# Altium project DLU_PPK57.PrjPCB (part 1 of 2)
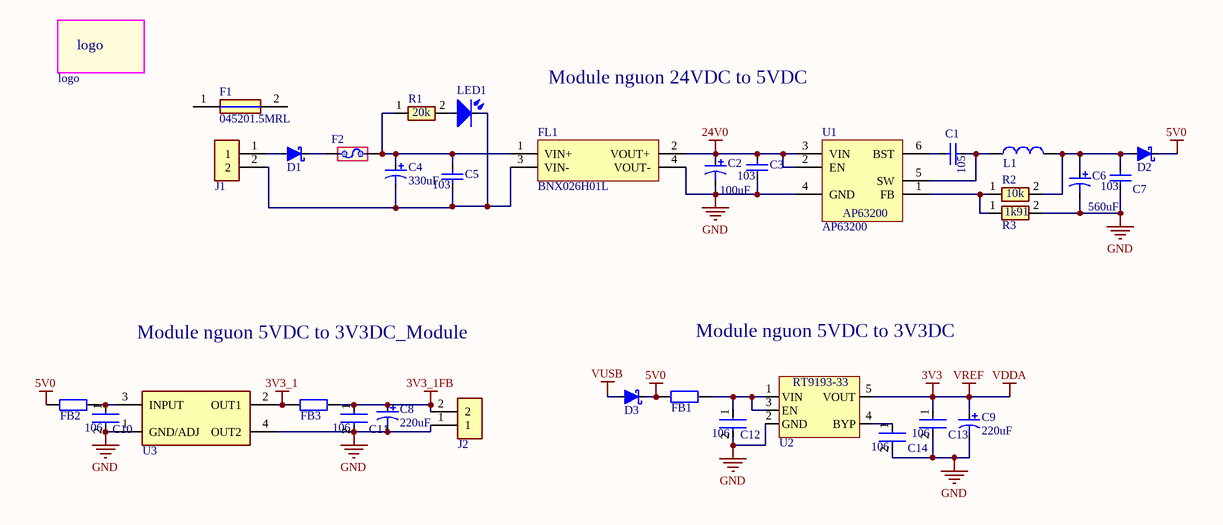
[diagram p0: [1]-Power.SchDoc]
4 sheets, 182 parts. Net scope: flat (ports and power ports of the same name join across sheets).
Board file: DLU_PPK57.PcbDoc
Sheets:
  [1]-Power.SchDoc
  [2]-MCU.SchDoc
  [3]-Digital Input.SchDoc
  [4]-GPS_SIM_SSD.SchDoc

## Sheet [1]-Power.SchDoc
size A4; DocumentNumber: 1; SheetNumber: 1; SheetTotal: 5

### Parts
1  logo  [logo_new_10mm]  (no BOM)
C1  C0603_105_50V  [C0603]  (value not drawn)
C2  100uF  [CAP_ALUM_6_5x6_5]
C3  C0603_103_50V  [C0603]  (value not drawn)
C4  330uF  [CAP_ALUM_10X10]
C5  C0603_103_50V  [C0603]  (value not drawn)
C6  value 560uF  [CAP_ALUM_6_5x6_5]  (hidden comment: CAP_ALU6.3_560uF_6.3V)
C7  C0603_103_50V  [C0603]  (value not drawn)
C8  value 220uF  [CAP_TAN_7343]  (hidden comment: CAP_TAN_7343_220uF_16V)
C9  value 220uF  [CAP_TAN_7343]  (hidden comment: CAP_TAN_7343_220uF_16V)
C10  C0603_106_35V  [C0603]  (value not drawn)
C11  C0603_106_35V  [C0603]  (value not drawn)
C12  C0603_106_35V  [C0603]  (value not drawn)
C13  C0603_106_35V  [C0603]  (value not drawn)
C14  C0603_106_35V  [C0603]  (value not drawn)
D1  PMEG40T30ERX  [SOD123]  (value not drawn)
D2  PMEG40T30ERX  [SOD123]  (value not drawn)
D3  PMEG40T30ERX  [SOD123]  (value not drawn)
F1  045201.5MRL
F2  01550900M  [FUSE_HOLDER_SMD]  (value not drawn)
FB1  FERRIT_0805_1A  [FB0805]  (value not drawn)
FB2  FERRIT_0805_1A  [FB0805]  (value not drawn)
FB3  FERRIT_0805_1A  [FB0805]  (value not drawn)
FL1  BNX026H01L  [BNX024]
J1  Terminal_2P_5.08mm  [1729128]  (value not drawn)
J2  Terminal_2P_5.08mm  [1729128]  (value not drawn)
L1  IND_4.7U_1.82A_4.5X4.0  [IND_4.5x4]  (value not drawn)
LED1  LED0603_Blue  [LED0603]  (value not drawn)
R1  R0603_20k  [RES-SMD-0603]  (value not drawn)
R2  R0603_10k  [RES-SMD-0603]  (value not drawn)
R3  R0603_1k91  [RES-SMD-0603]  (value not drawn)
U1  AP63200  [SOT-23-6]
U2  RT9193-33GB  [SOT-23-5]  (value not drawn)
U3  NCP1117ST33T3G  [SOT230P700X180-4N]  (value not drawn)

### Nets
3V3: C9.1 C13.1 U2.5(VOUT)  [also labelled VDDA, VREF]
3V3_1: FB3.1 U3.2(OUT1)
3V3_1FB: C8.1 C11.1 FB3.2 J2.2
5V0: D2.2(K) D3.2(K) FB1.1 FB2.1
24V0: C2.1 C3.1 FL1.2(VOUT+) U1.2(EN) U1.3(VIN)
GND: C2.2 C3.2 C6.2 C7.2 C8.2 C9.2 C10.2 C11.2 C12.2 C13.2 C14.2 FL1.4(VOUT-) J2.1 R3.2 U1.4(GND) U2.2(GND) U3.1(GND/ADJ) U3.4(OUT2)
VUSB: D3.1(A)
NetC1_1: C1.1 U1.6(BST)
NetC1_2: C1.2 L1.1 U1.5(SW)
NetC4_1: C4.1 C5.1 F2.2 FL1.1(VIN+) R1.1
NetC4_2: C4.2 C5.2 FL1.3(VIN-) J1.2 LED1.1(K)
NetC6_1: C6.1 C7.1 D2.1(A) L1.2 R2.2
NetC10_1: C10.1 FB2.2 U3.3(INPUT)
NetC12_1: C12.1 FB1.2 U2.1(VIN) U2.3(EN)
NetC14_1: C14.1 U2.4(BYP)
NetD1_1: D1.1(A) J1.1
NetD1_2: D1.2(K) F2.1
NetLED1_2: LED1.2(A) R1.2
NetR2_1: R2.1 R3.1 U1.1(FB)

Not connected (* = marked no-connect by the designer): F1 1 2

### Notes on the sheet
- Module nguon 24VDC to 5VDC
- Module nguon 5VDC to 3V3DC_Module
- Module nguon 5VDC to 3V3DC
- Sửa đổi
- 1
- Miêu tả
- CHỈNH SỬA
- Khu vực
- Thời gian
- 2
- 3
- 4
- Họ Tên
- Chữ ký
- Ngày ký
- TỔNG CÔNG TY CÔNG NGHIỆP CNC VIETTEL
- Mã dự án
- THIẾT KẾ:
- XUẤT BẢN VẼ:
- Bản vẽ thiết kế sơ đồ nguyên lý
- TRUNG TÂM CN CK & TĐH
- KHỐI 1
- KIỂM TRA:
- Mã thiết bị
- Mã bản vẽ
- PHÊ DUYỆT:
- Tên file:
- Mã phiên bản
- Kích thước
- A4
- Trang
- (in symbol C0603_103_50V) 103
- (in symbol C0603_105_50V) 105
- (in symbol C0603_106_35V) 106
- (in symbol R0603_1k91) 1k91
- (in symbol R0603_10k) 10k
- (in symbol R0603_20k) 20k
- (in symbol RT9193-33GB) RT9193-33

### Library data of the parts
C1 = C0603_105_50V: Multilayer Ceramic Capacitors MLCC - SMD/SMT 50 V 1uF X7R 0603 10%; Manufacturer_Name: KEMET; Manufacturer_Part_Number: CC0603KRX7R9BB105; Datasheet Link: https://componentsearchengine.com/Datasheets/1/CC0603KRX7R9BB105.pdf; Height: 0.9mm; Mouser Part Number: 603-CC603KRX7R9BB105; Mouser Price/Stock: https://www.mouser.co.uk/ProductDetail/YAGEO/CC0603KRX7R9BB105?qs=6wERJjOp3mmF17%252BYi8cgJQ%3D%3D; Arrow Part Number: CC0603KRX7R9BB105; Arrow Price/Stock: https://www.arrow.com/en/products/cc0603krx7r9bb105/yageo
C2 = C_Al_100uF_35V: Capacitor Polarised; Manufacturer_Name: Panasonic; Manufacturer_Part_Number: EEH-ZK1V101XP; Datasheet Link: http://industrial.panasonic.com/cdbs/www-data/pdf/RDD0000/ABA0000C1229.pdf; Height: 8.3mm; Mouser Part Number: 667-EEH-ZK1V101XP; Mouser Price/Stock: https://www.mouser.co.uk/ProductDetail/Panasonic/EEH-ZK1V101XP?qs=FNcb6ahWXRxBYa2YKGAU8g%3D%3D; Arrow Part Number: EEH-ZK1V101XP; Arrow Price/Stock: https://www.arrow.com/en/products/eeh-zk1v101xp/panasonic
C3 C5 C7 = C0603_103_50V: Multilayer Ceramic Capacitors MLCC - SMD/SMT 50V 0.01uF X7R 0603 10%; Manufacturer_Name: KEMET; Manufacturer_Part_Number: CC0603KRX7R9BB103; Datasheet Link: https://datasheet.datasheetarchive.com/originals/distributors/Datasheets_SAMA/d9f127a4875522309d99aa7dec79633c.pdf; Height: 0.9mm; Mouser Part Number: 603-CC603KRX7R9BB103; Mouser Price/Stock: https://www.mouser.co.uk/ProductDetail/YAGEO/CC0603KRX7R9BB103?qs=AgBp2OyFlx%252BeoRRspw6PJg%3D%3D; Arrow Part Number: CC0603KRX7R9BB103; Arrow Price/Stock: https://www.arrow.com/en/products/cc0603krx7r9bb103/yageo?region=nac
C4 = C_Al_330uF_35V: Aluminum Organic Polymer Capacitors 35Vol 330uF SMD 2KHr ESR=22 mOhms AECQ200; Manufacturer_Name: KEMET; Manufacturer_Part_Number: A768MS337M1VLAS022; Datasheet Link: https://www.mouser.vn/datasheet/2/447/KEM_A4088_A768-3316438.pdf; Height: 12.2 mm; Mouser Part Number: 80-A768MS337M1VLAS22; Mouser Price/Stock: https://www.mouser.vn/ProductDetail/KEMET/A768MS337M1VLAS022?qs=sPbYRqrBIVliRmrbB6XsUw%3D%3D; ComponentLink1Description: Link; ComponentLink1URL: https://www.mouser.vn/ProductDetail/KEMET/A768MS337M1VLAS022?qs=sPbYRqrBIVliRmrbB6XsUw%3D%3D
C6 = CAP_ALU6.3_560uF_6.3V: 560 µF 6.3 V Aluminum - Polymer Capacitors Radial, Can - SMD 8mOhm 15000 Hrs @ 105°C; Manufacturer: United Chemi-Con; Part Number: APXJ6R3ARA561MF80G; Info: CAP ALUM POLY 560UF 20% 6.3V SMD; Temperature: -55°C ~ 105°C; URL: https://www.digikey.com/en/products/detail/chemi-con/APXJ6R3ARA561MF80G/10486574?s=N4IgjCBcoGwJxVAYygMwIYBsDOBTANCAPZQDaIALAAxwDMdIAuoQA4AuUIAymwE4CWAOwDmIAL6EA7ACYKiECkgYcBYmRDS4FAKzbpTVh0jc%2BQ0RJAAOS3OgK0WPIRKRyYGDDC0DIdpx4CIuKE0lQUCHaKyk5qriDaMFQABACtAGI%2BfsYAqoL8bADyqACyuOjYAK68uMEaVJIRyA4qzuowAHS0SQBqIIRgyb3MvkYguflFpeVVNRYAtPqRUHwVqi7k2n0gCIxie0A; Price: 0.87; Manufacturer Part Number: APXJ6R3ARA561MF80G
C8 C9 = CAP_TAN_7343_220uF_16V: 220 µF Molded Tantalum Capacitors 16 V 2917 (7343 Metric) 25mOhm; Manufacturer: KYOCERA AVX; Part Number: TPME227K016R0025; Info: CAP TANT 220UF 10% 16V 2917; Temperature: -55°C ~ 125°C; URL: https://www.digikey.com/en/products/detail/kyocera-avx/TPME227K016R0025/929934; Price: 4.54; Manufacturer Part Number: TPME227K016R0025
C10-C14 = C0603_106_35V: Multilayer Ceramic Capacitors MLCC - SMD/SMT 10 uF 35 VDC 20% 0603 X5R; Manufacturer_Name: Murata Electronics; Manufacturer_Part_Number: GRM188R6YA106MA73J; Datasheet Link: http://componentsearchengine.com/Datasheets/1/GRM188R6YA106MA73J.pdf; Height: 0.9mm; Mouser Part Number: 81-GRM188R6YA106MA3J; Mouser Price/Stock: https://www.mouser.co.uk/ProductDetail/Murata-Electronics/GRM188R6YA106MA73J?qs=5aG0NVq1C4xLSwNPdfnaYg%3D%3D; Arrow Part Number: GRM188R6YA106MA73J; Arrow Price/Stock: https://www.arrow.com/en/products/grm188r6ya106ma73j/murata-manufacturing?region=europe
D1-D3 = PMEG40T30ERX: Schottky Diode 40V 3A; Manufacturer_Name: Nexperia; Datasheet Link: https://assets.nexperia.com/documents/data-sheet/PMEG40T30ER.pdf; Height: 1.1mm; Manufacturer_Part_Number: PMEG40T30ERX; Mouser Part Number: 771-PMEG40T30ERX; Mouser Price/Stock: https://www.mouser.co.uk/ProductDetail/Nexperia/PMEG40T30ERX?qs=1mbolxNpo8eeG%2Fr5KLvXLA%3D%3D; Arrow Part Number: PMEG40T30ERX; Arrow Price/Stock: https://www.arrow.com/en/products/pmeg40t30erx/nexperia?region=europe
F1 = 045201.5MRL: Fuse; Manufacturer_Name: LITTELFUSE; Datasheet Link: https://componentsearchengine.com/Datasheets/2/045201.5MRL.pdf; Height: 2.69mm; Manufacturer_Part_Number: 045201.5MRL; Mouser Part Number: 576-045201.5MRL; Mouser Price/Stock: https://www.mouser.co.uk/ProductDetail/Littelfuse/045201.5MRL?qs=WtG364jHAdxFkoGkhC9sHA%3D%3D; Arrow Part Number: 045201.5MRL; Arrow Price/Stock: https://www.arrow.com/en/products/045201.5mrl/littelfuse?region=nac
F2 = 01550900M: Fuse holder; Manufacturer_Name: LITTELFUSE; Datasheet Link: http://www.littelfuse.com/~/media/electronics/datasheets/fuses/littelfuse_fuse_154_154t_154l_154tl_datasheet.pdf.pdf; Height: 3.81mm; Manufacturer_Part_Number: 01550900M; Mouser Part Number: 576-01550900M; Mouser Price/Stock: https://www.mouser.co.uk/ProductDetail/Littelfuse/01550900M?qs=DDoybve0rC%252BTXq1hqi5X1g%3D%3D; Arrow Part Number: 01550900M; Arrow Price/Stock: https://www.arrow.com/en/products/01550900m/littelfuse?region=europe
FB1-FB3 = FERRIT_0805_1A: Manufacturer: Laird-Signal Integrity Products; Part Number: MI0805J102R-10; info: FERRITE BEAD 1 KOHM 0805 1LN; Temperature: -40°C ~ 125°C; URL: https://www.digikey.com/en/products/detail/laird-signal-integrity-products/MI0805J102R-10/1015975; Price: 0.2; Manufacturer Part Number: MI0805J102R-10
FL1 = BNX026H01L: Filter; Manufacturer_Name: Murata Electronics; Datasheet Link: https://www.murata.com/en-us/products/productdetail?partno=BNX026H01%23; Height: 3.7mm; Manufacturer_Part_Number: BNX026H01L; Mouser Part Number: 81-BNX026H01L; Mouser Price/Stock: https://www.mouser.co.uk/ProductDetail/Murata-Electronics/BNX026H01L?qs=zU3EaVYbc3y78A%2FfsSIPhQ%3D%3D; Arrow Part Number: BNX026H01L; Arrow Price/Stock: https://www.arrow.com/en/products/bnx026h01l/murata-manufacturing?region=nac
J1 J2 = Terminal_2P_5.08mm: Fixed Terminal Blocks 2P 5.08mm 90DEG; Manufacturer_Name: Phoenix Contact; Datasheet Link: http://www.phoenixcontact.net/product/1729128; Height: 10.15mm; Manufacturer_Part_Number: 1729128; Mouser Part Number: 651-1729128; Mouser Price/Stock: https://www.mouser.co.uk/ProductDetail/Phoenix-Contact/1729128?qs=GFUSqQMLmmnCBVBY3dts9w%3D%3D; Arrow Part Number: 1729128; Arrow Price/Stock: https://www.arrow.com/en/products/1729128/phoenix-contact?region=nac
L1 = IND_4.7U_1.82A_4.5X4.0: Manufacturer: Würth Elektronik; Part Number: 744773047; info: FIXED IND 4.7UH 1.82A 110MOHM SM; Value: 4.7uH; Temperature: -40°C ~ 125°C; URL: https://www.digikey.com/en/products/detail/w%C3%BCrth-elektronik/744773047/1638657; Price: 1.8; Manufacturer Part Number: 744773047
LED1 = LED0603_Blue: Blue 470nm LED Indication - Discrete 3.2V 0603 (1608 Metric); Manufacturer_Name: Wurth Elektronik; Manufacturer_Part_Number: 150060BS75000; Datasheet Link: https://componentsearchengine.com/Datasheets/2/150060BS75000.pdf; Height: 0.8mm; Mouser Part Number: 710-150060BS75000; Mouser Price/Stock: https://www.mouser.co.uk/ProductDetail/Wurth-Elektronik/150060BS75000?qs=LlUlMxKIyB2DLLpXQThavA%3D%3D
R1 = R0603_20k: Resistor; Manufacturer_Name: Panasonic; Manufacturer_Part_Number: ERJ-3EKF2002V; Datasheet Link: http://industrial.panasonic.com/cdbs/www-data/pdf/RDA0000/AOA0000C86.pdf; Height: 0.55mm; Mouser Part Number: 667-ERJ-3EKF2002V; Mouser Price/Stock: https://www.mouser.co.uk/ProductDetail/Panasonic/ERJ-3EKF2002V?qs=66DK8nO8gJB3y0uxig0mNg%3D%3D; Arrow Part Number: ERJ-3EKF2002V; Arrow Price/Stock: https://www.arrow.com/en/products/erj-3ekf2002v/panasonic?region=europe
R2 = R0603_10k: Thick Film Resistors - SMD 0603 10Kohms 1% AEC-Q200; Manufacturer_Name: Panasonic; Manufacturer_Part_Number: ERJ-3EKF1002V; Datasheet Link: http://industrial.panasonic.com/cdbs/www-data/pdf/RDA0000/AOA0000C86.pdf; Height: 0.55mm; Mouser Part Number: 667-ERJ-3EKF1002V; Mouser Price/Stock: https://www.mouser.co.uk/ProductDetail/Panasonic/ERJ-3EKF1002V?qs=H7k1u0Mp9JSrGPQ5%2F5COuw%3D%3D; Arrow Part Number: ERJ-3EKF1002V; Arrow Price/Stock: https://www.arrow.com/en/products/erj-3ekf1002v/panasonic?region=europe
R3 = R0603_1k91: Resistor; Manufacturer_Name: Panasonic; Manufacturer_Part_Number: ERJ-3EKF1911V; Datasheet Link: http://industrial.panasonic.com/cdbs/www-data/pdf/RDA0000/AOA0000C86.pdf; Height: 0.55mm; Mouser Part Number: 667-ERJ-3EKF1911V; Mouser Price/Stock: https://www.mouser.co.uk/ProductDetail/Panasonic/ERJ-3EKF1911V?qs=66DK8nO8gJBdy91mE9RmMA%3D%3D; Arrow Part Number: ERJ-3EKF1911V; Arrow Price/Stock: https://www.arrow.com/en/products/erj-3ekf1911v/panasonic?region=nac
U1 = AP63200: Buck Switching Regulator IC Positive Adjustable 1.2V 1 Output 2A SOT-23-6 Thin, TSOT-23-6; Manufacturer: Diodes Incorporated; Part Number: AP63200WU-7; Temperature: -40°C ~ 85°C (TA); URL: https://www.digikey.com/en/products/detail/diodes-incorporated/AP63200WU-7/9858423; Price: 0.91; Info: Buck Switching Regulator IC Positive Adjustable 1.2V 1 Output 2A SOT-23-6 Thin, TSOT-23-6; Manufacturer Part Number: AP63200WU-7
U2 = RT9193-33GB: Linear Voltage Regulator IC Positive Fixed 1 Output 300mA SOT-23-5; Manufacturer: Richtek USA Inc.; info: IC REG LINEAR 3.3V 300MA SOT23-5; Part Number: RT9193-33GB; Temperature: -40°C ~ 125°C; URL: https://www.digikey.com/en/products/detail/richtek-usa-inc/RT9193-33GB/2470048?s=N4IgTCBcDaIEoBUCcBGJBmAtO9BxAQiALoC%2BQA; Price: 0.56; Type: IC; Manufacturer Part Number: RT9193-33GB
U3 = NCP1117ST33T3G: LDO Voltage Regulators 3.3V 1A Positive; Manufacturer_Name: onsemi; Datasheet Link: http://www.onsemi.com/pub/Collateral/NCP1117-D.PDF; Height: 1.8mm; Manufacturer_Part_Number: NCP1117ST33T3G; Mouser Part Number: 863-NCP1117ST33T3G; Mouser Price/Stock: https://www.mouser.co.uk/ProductDetail/onsemi/NCP1117ST33T3G?qs=Gev%252BmEvV0iZb%2FE8ahUDx3w%3D%3D; Arrow Part Number: NCP1117ST33T3G; Arrow Price/Stock: https://www.arrow.com/en/products/ncp1117st33t3g/on-semiconductor?region=europe

## Sheet [2]-MCU.SchDoc
size A2; DocumentNumber: 2; SheetNumber: 2; SheetTotal: 5
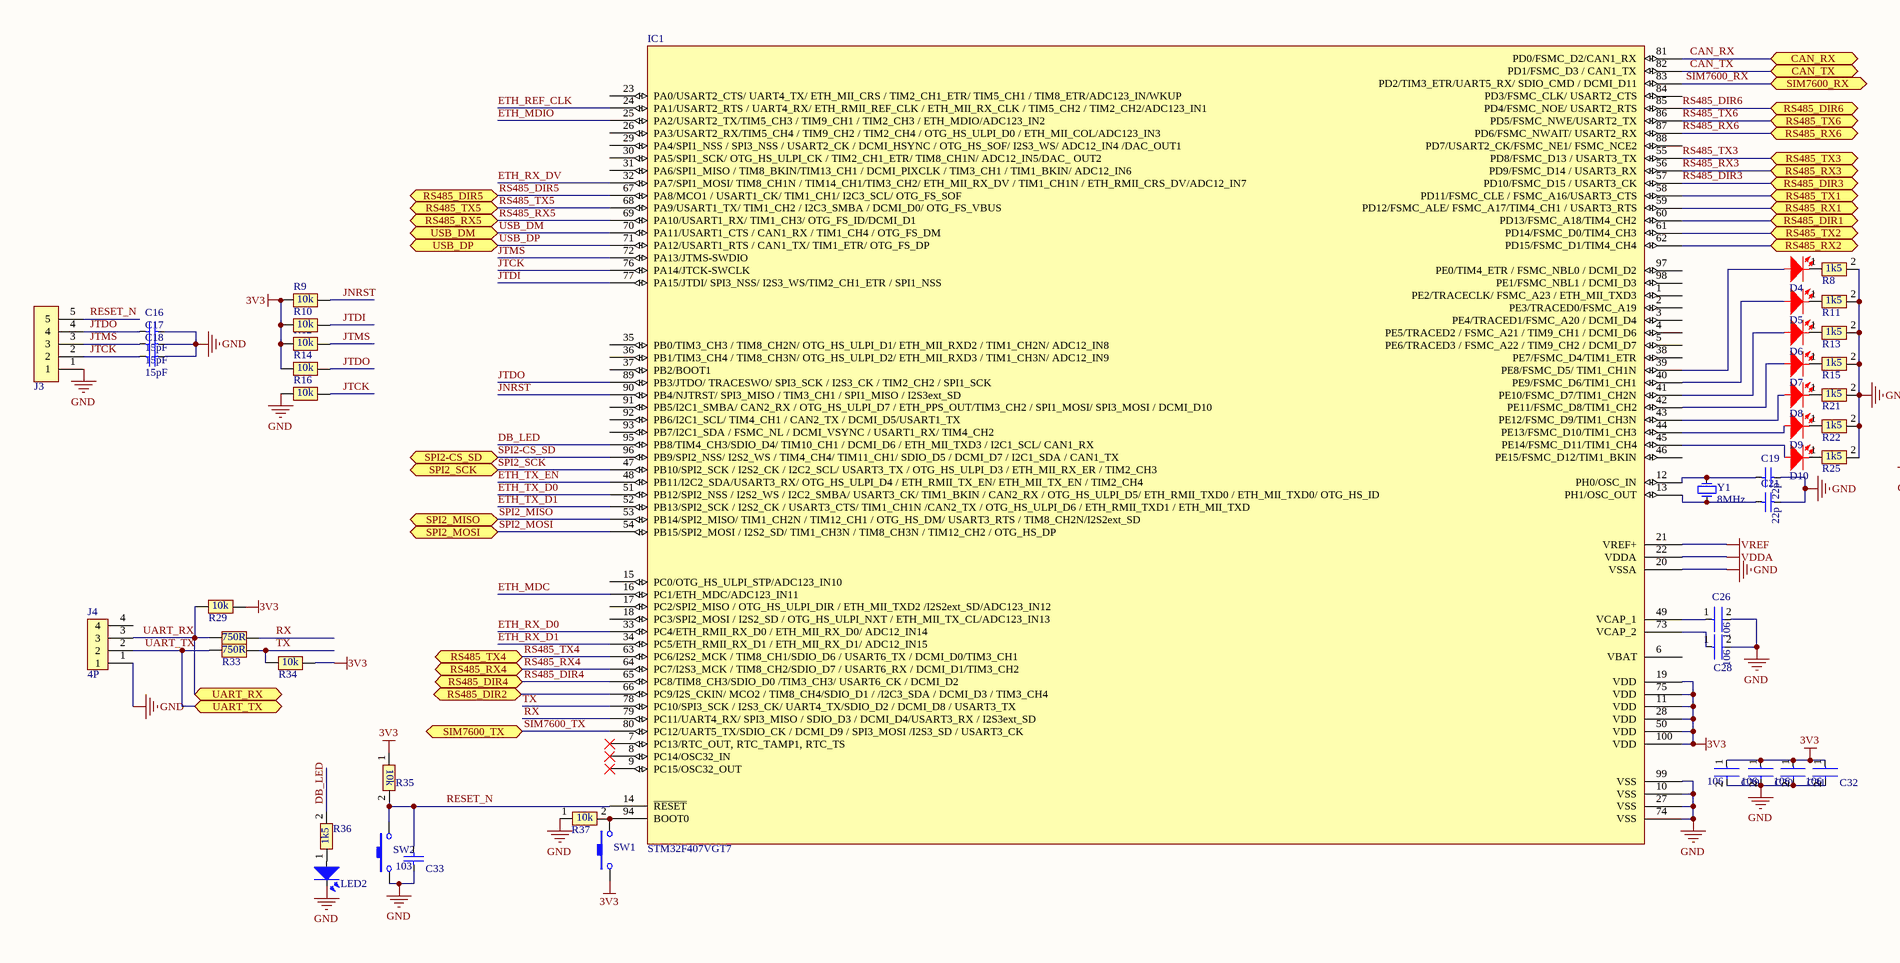
[diagram p1: [2]-MCU.SchDoc, left]
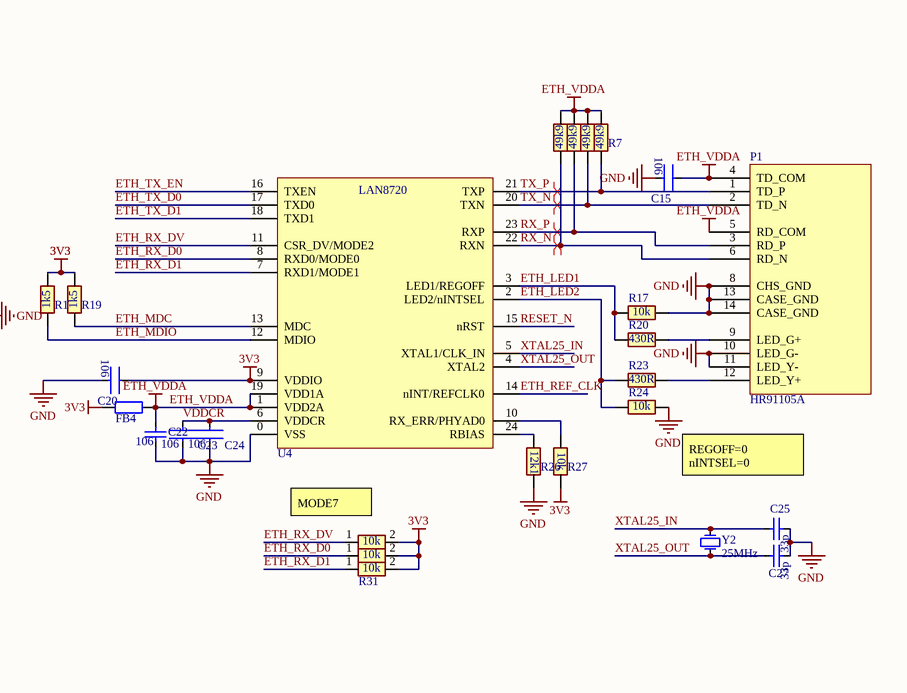
[diagram p2: [2]-MCU.SchDoc, right]

### Parts
C15  C0603_106_35V  [C0603]  (value not drawn)
C16  15pF  [C0603]
C17  15pF  [C0603]
C18  15pF  [C0603]
C19  C0603_22p_50V  [C0603]  (value not drawn)
C20  C0603_106_35V  [C0603]  (value not drawn)
C21  C0603_22p_50V  [C0603]  (value not drawn)
C22  C0603_106_10V  [C0603]  (value not drawn)
C23  C0603_106_35V  [C0603]  (value not drawn)
C24  C0603_106_35V  [C0603]  (value not drawn)
C25  C0603_33p_50V  [C0603]  (value not drawn)
C26  C0603_106_35V  [C0603]  (value not drawn)
C27  C0603_33p_50V  [C0603]  (value not drawn)
C28  C0603_106_35V  [C0603]  (value not drawn)
C29  C0603_106_35V  [C0603]  (value not drawn)
C30  C0603_106_35V  [C0603]  (value not drawn)
C31  C0603_106_35V  [C0603]  (value not drawn)
C32  C0603_106_35V  [C0603]  (value not drawn)
C33  C0603_103_50V  [C0603]  (value not drawn)
D4  LED0603_Red  [LED0603]  (value not drawn)
D5  LED0603_Red  [LED0603]  (value not drawn)
D6  LED0603_Red  [LED0603]  (value not drawn)
D7  LED0603_Red  [LED0603]  (value not drawn)
D8  LED0603_Red  [LED0603]  (value not drawn)
D9  LED0603_Red  [LED0603]  (value not drawn)
D10  LED0603_Red  [LED0603]  (value not drawn)
FB4  FERRIT_0603_500mA  [L0603]  (value not drawn)
IC1  STM32F407VGT7  [LQFP-100]
J3  Header_5P_Male Pin  [HDRV5W66P0X254_1X5_1270X249X863P]  (value not drawn)
J4  4P  [HDRV4W95P0X254_1X4_1016X254X854P]
LED2  LED0603_Blue  [LED0603]  (value not drawn)
P1  HR91105A  [HR91105A]
R4  R0603_49k9  [RES-SMD-0603]  (value not drawn)
R5  R0603_49k9  [RES-SMD-0603]  (value not drawn)
R6  R0603_49k9  [RES-SMD-0603]  (value not drawn)
R7  R0603_49k9  [RES-SMD-0603]  (value not drawn)
R8  R0603_1k5  [RES-SMD-0603]  (value not drawn)
R9  R0603_10k  [RES-SMD-0603]  (value not drawn)
R10  R0603_10k  [RES-SMD-0603]  (value not drawn)
R11  R0603_1k5  [RES-SMD-0603]  (value not drawn)
R12  R0603_10k  [RES-SMD-0603]  (value not drawn)
R13  R0603_1k5  [RES-SMD-0603]  (value not drawn)
R14  R0603_10k  [RES-SMD-0603]  (value not drawn)
R15  R0603_1k5  [RES-SMD-0603]  (value not drawn)
R16  R0603_10k  [RES-SMD-0603]  (value not drawn)
R17  R0603_10k  [RES-SMD-0603]  (value not drawn)
R18  R0603_1k5  [RES-SMD-0603]  (value not drawn)
R19  R0603_1k5  [RES-SMD-0603]  (value not drawn)
R20  R0603_430R  [RES-SMD-0603]  (value not drawn)
R21  R0603_1k5  [RES-SMD-0603]  (value not drawn)
R22  R0603_1k5  [RES-SMD-0603]  (value not drawn)
R23  R0603_430R  [RES-SMD-0603]  (value not drawn)
R24  R0603_10k  [RES-SMD-0603]  (value not drawn)
R25  R0603_1k5  [RES-SMD-0603]  (value not drawn)
R26  R0603_12k1  [RES-SMD-0603]  (value not drawn)
R27  R0603_10k  [RES-SMD-0603]  (value not drawn)
R28  R0603_10k  [RES-SMD-0603]  (value not drawn)
R29  R0603_10k  [RES-SMD-0603]  (value not drawn)
R30  R0603_10k  [RES-SMD-0603]  (value not drawn)
R31  R0603_10k  [RES-SMD-0603]  (value not drawn)
R32  R0603_750R  [RES-SMD-0603]  (value not drawn)
R33  R0603_750R  [RES-SMD-0603]  (value not drawn)
R34  R0603_10k  [RES-SMD-0603]  (value not drawn)
R35  R0603_10k  [RES-SMD-0603]  (value not drawn)
R36  R0603_1k5  [RES-SMD-0603]  (value not drawn)
R37  R0603_10k  [RES-SMD-0603]  (value not drawn)
SW1  BUTTON_SMD  [SW-SMD]  (value not drawn)
SW2  BUTTON_SMD  [SW-SMD]  (value not drawn)
U4  LAN_8720  [QFN24_V2]  (value not drawn)
Y1  value 8MHz  [2_SMD_5032]  (hidden comment: CRYSTAL_8MHz_SMD)
Y2  value 25MHz  [XTAL_THOUGH]  (hidden comment: CRYSTAL_25MHz)

### Ports
CAN_RX (bidir), CAN_TX (bidir), RS485_DIR1 (bidir), RS485_DIR2 (bidir), RS485_DIR3 (bidir), RS485_DIR4 (bidir), RS485_DIR5 (bidir), RS485_DIR6 (bidir), RS485_RX1 (bidir), RS485_RX2 (bidir), RS485_RX3 (bidir), RS485_RX4 (bidir), RS485_RX5 (bidir), RS485_RX6 (bidir), RS485_TX1 (bidir), RS485_TX2 (bidir), RS485_TX3 (bidir), RS485_TX4 (bidir), RS485_TX5 (bidir), RS485_TX6 (bidir), SIM7600_RX (bidir), SIM7600_TX (bidir), SPI2-CS_SD (bidir), SPI2_MISO (bidir), SPI2_MOSI (bidir), SPI2_SCK (bidir), UART_RX (bidir), UART_TX (bidir), USB_DM (bidir), USB_DP (bidir)

### Nets
3V3: C20.1 C29.1 C30.1 C31.1 C32.1 FB4.1 IC1.11(VDD) IC1.19(VDD) IC1.21(VREF+) IC1.22(VDDA) IC1.28(VDD) IC1.50(VDD) IC1.75(VDD) IC1.100(VDD) R9.1 R10.1 R12.1 R14.1 R18.2 R19.2 R27.2 R28.2 R29.2 R30.2 R31.2 R34.2 R35.1 SW1.1 U4.9(VDDIO)  [also labelled VDDA, VREF]
ETH_VDDA: C15.1 C22.1 FB4.2 P1.4(TD_COM) P1.5(RD_COM) R4.2 R5.2 R6.2 R7.2 U4.1(VDD2A) U4.19(VDD1A)
GND: C15.2 C16.2 C17.2 C18.2 C19.2 C20.2 C21.2 C22.2 C23.2 C24.2 C25.2 C26.2 C27.2 C28.2 C29.2 C30.2 C31.2 C32.2 C33.2 IC1.10(VSS) IC1.20(VSSA) IC1.27(VSS) IC1.74(VSS) IC1.99(VSS) J3.1 J4.1 LED2.1(K) P1.8(CHS_GND) P1.10(LED_G-) P1.11(LED_Y-) P1.13(CASE_GND) P1.14(CASE_GND) R8.2 R11.2 R13.2 R15.2 R16.1 R17.2 R21.2 R22.2 R24.2 R25.2 R26.2 R37.1 SW2.1 U4.0(VSS)
CAN_RX: IC1.81(PD0/FSMC_D2/CAN1_RX) ; port CAN_RX
CAN_TX: IC1.82(PD1/FSMC_D3_/_CAN1_TX) ; port CAN_TX
DB_LED: IC1.95(PB8/TIM4_CH3/SDIO_D4/_TIM10_CH1_/_DCMI_D6_/_ETH_MII_TXD3_/_I2C1_SCL/_CAN1_RX) R36.2
ETH_LED1: R17.1 R20.1 U4.3(LED1/REGOFF)
ETH_LED2: R23.1 R24.1 U4.2(LED2/nINTSEL)
ETH_MDC: IC1.16(PC1/ETH_MDC/ADC123_IN11) R19.1 U4.13(MDC)
ETH_MDIO: IC1.25(PA2/USART2_TX/TIM5_CH3_/_TIM9_CH1_/_TIM2_CH3_/_ETH_MDIO/ADC123_IN2) R18.1 U4.12(MDIO)
ETH_REF_CLK: IC1.24(PA1/USART2_RTS_/_UART4_RX/_ETH_RMII_REF_CLK_/_ETH_MII_RX_CLK_/_TIM5_CH2_/_TIM2_CH2/ADC123_IN1) U4.14(nINT/REFCLK0)
ETH_RX_D0: IC1.33(PC4/ETH_RMII_RX_D0_/_ETH_MII_RX_D0/_ADC12_IN14) R30.1 U4.8(RXD0/MODE0)
ETH_RX_D1: IC1.34(PC5/ETH_RMII_RX_D1_/_ETH_MII_RX_D1/_ADC12_IN15) R31.1 U4.7(RXD1/MODE1)
ETH_RX_DV: IC1.32(PA7/SPI1_MOSI/_TIM8_CH1N_/_TIM14_CH1/TIM3_CH2/_ETH_MII_RX_DV_/_TIM1_CH1N_/_ETH_RMII_CRS_DV/ADC12_IN7) R28.1 U4.11(CSR_DV/MODE2)
ETH_TX_D0: IC1.51(PB12/SPI2_NSS_/_I2S2_WS_/_I2C2_SMBA/_USART3_CK/_TIM1_BKIN_/_CAN2_RX_/_OTG_HS_ULPI_D5/_ETH_RMII_TXD0_/_ETH_MII_TXD0/_OTG_HS_ID) U4.17(TXD0)
ETH_TX_D1: IC1.52(PB13/SPI2_SCK_/_I2S2_CK_/_USART3_CTS/_TIM1_CH1N_/CAN2_TX_/_OTG_HS_ULPI_D6_/_ETH_RMII_TXD1_/_ETH_MII_TXD) U4.18(TXD1)
ETH_TX_EN: IC1.48(PB11/I2C2_SDA/USART3_RX/_OTG_HS_ULPI_D4_/_ETH_RMII_TX_EN/_ETH_MII_TX_EN_/_TIM2_CH4) U4.16(TXEN)
JNRST: IC1.90(PB4/NJTRST/_SPI3_MISO_/_TIM3_CH1_/_SPI1_MISO_/_I2S3ext_SD) R9.2
JTCK: C18.1 IC1.76(PA14/JTCK-SWCLK) J3.2 R16.2
JTDI: IC1.77(PA15/JTDI/_SPI3_NSS/_I2S3_WS/TIM2_CH1_ETR_/_SPI1_NSS) R10.2
JTDO: C16.1 IC1.89(PB3/JTDO/_TRACESWO/_SPI3_SCK_/_I2S3_CK_/_TIM2_CH2_/_SPI1_SCK) J3.4 R14.2
JTMS: C17.1 IC1.72(PA13/JTMS-SWDIO) J3.3 R12.2
RESET_N: C33.1 IC1.14(~{RESET}) J3.5 R35.2 SW2.2 U4.15(nRST)
RS485_DIR1: IC1.60(PD13/FSMC_A18/TIM4_CH2) ; port RS485_DIR1
RS485_DIR2: IC1.66(PC9/I2S_CKIN/_MCO2_/_TIM8_CH4/SDIO_D1_/_/I2C3_SDA_/_DCMI_D3_/_TIM3_CH4) ; port RS485_DIR2
RS485_DIR3: IC1.57(PD10/FSMC_D15_/_USART3_CK) ; port RS485_DIR3
RS485_DIR4: IC1.65(PC8/TIM8_CH3/SDIO_D0_/TIM3_CH3/_USART6_CK_/_DCMI_D2) ; port RS485_DIR4
RS485_DIR5: IC1.67(PA8/MCO1_/_USART1_CK/_TIM1_CH1/_I2C3_SCL/_OTG_FS_SOF) ; port RS485_DIR5
RS485_DIR6: IC1.85(PD4/FSMC_NOE/_USART2_RTS) ; port RS485_DIR6
RS485_RX1: IC1.59(PD12/FSMC_ALE/_FSMC_A17/TIM4_CH1_/_USART3_RTS) ; port RS485_RX1
RS485_RX2: IC1.62(PD15/FSMC_D1/TIM4_CH4) ; port RS485_RX2
RS485_RX3: IC1.56(PD9/FSMC_D14_/_USART3_RX) ; port RS485_RX3
RS485_RX4: IC1.64(PC7/I2S3_MCK_/_TIM8_CH2/SDIO_D7_/_USART6_RX_/_DCMI_D1/TIM3_CH2) ; port RS485_RX4
RS485_RX5: IC1.69(PA10/USART1_RX/_TIM1_CH3/_OTG_FS_ID/DCMI_D1) ; port RS485_RX5
RS485_RX6: IC1.87(PD6/FSMC_NWAIT/_USART2_RX) ; port RS485_RX6
RS485_TX1: IC1.58(PD11/FSMC_CLE_/_FSMC_A16/USART3_CTS) ; port RS485_TX1
RS485_TX2: IC1.61(PD14/FSMC_D0/TIM4_CH3) ; port RS485_TX2
RS485_TX3: IC1.55(PD8/FSMC_D13_/_USART3_TX) ; port RS485_TX3
RS485_TX4: IC1.63(PC6/I2S2_MCK_/_TIM8_CH1/SDIO_D6_/_USART6_TX_/_DCMI_D0/TIM3_CH1) ; port RS485_TX4
RS485_TX5: IC1.68(PA9/USART1_TX/_TIM1_CH2_/_I2C3_SMBA_/_DCMI_D0/_OTG_FS_VBUS) ; port RS485_TX5
RS485_TX6: IC1.86(PD5/FSMC_NWE/USART2_TX) ; port RS485_TX6
RX: IC1.79(PC11/UART4_RX/_SPI3_MISO_/_SDIO_D3_/_DCMI_D4/USART3_RX_/_I2S3ext_SD) R32.2
RX_N: P1.6(RD_N) R4.1 U4.22(RXN)
RX_P: P1.3(RD_P) R5.1 U4.23(RXP)
SIM7600_RX: IC1.83(PD2/TIM3_ETR/UART5_RX/_SDIO_CMD_/_DCMI_D11) ; port SIM7600_RX
SIM7600_TX: IC1.80(PC12/UART5_TX/SDIO_CK_/_DCMI_D9_/_SPI3_MOSI_/I2S3_SD_/_USART3_CK) ; port SIM7600_TX
SPI2-CS_SD: IC1.96(PB9/SPI2_NSS/_I2S2_WS_/_TIM4_CH4/_TIM11_CH1/_SDIO_D5_/_DCMI_D7_/_I2C1_SDA_/_CAN1_TX) ; port SPI2-CS_SD
SPI2_MISO: IC1.53(PB14/SPI2_MISO/_TIM1_CH2N_/_TIM12_CH1_/_OTG_HS_DM/_USART3_RTS_/_TIM8_CH2N/I2S2ext_SD) ; port SPI2_MISO
SPI2_MOSI: IC1.54(PB15/SPI2_MOSI_/_I2S2_SD/_TIM1_CH3N_/_TIM8_CH3N_/_TIM12_CH2_/_OTG_HS_DP) ; port SPI2_MOSI
SPI2_SCK: IC1.47(PB10/SPI2_SCK_/_I2S2_CK_/_I2C2_SCL/_USART3_TX_/_OTG_HS_ULPI_D3_/_ETH_MII_RX_ER_/_TIM2_CH3) ; port SPI2_SCK
TX: IC1.78(PC10/SPI3_SCK_/_I2S3_CK/_UART4_TX/SDIO_D2_/_DCMI_D8_/_USART3_TX) R33.2 R34.1
TX_N: P1.2(TD_N) R6.1 U4.20(TXN)
TX_P: P1.1(TD_P) R7.1 U4.21(TXP)
UART_RX: J4.3 R29.1 R32.1 ; port UART_RX
UART_TX: J4.2 R33.1 ; port UART_TX
USB_DM: IC1.70(PA11/USART1_CTS_/_CAN1_RX_/_TIM1_CH4_/_OTG_FS_DM) ; port USB_DM
USB_DP: IC1.71(PA12/USART1_RTS_/_CAN1_TX/_TIM1_ETR/_OTG_FS_DP) ; port USB_DP
VDDCR: C23.1 C24.1 U4.6(VDDCR)
XTAL25_IN: C25.1 U4.5(XTAL1/CLK_IN) Y2.1(OSC1)
XTAL25_OUT: C27.1 U4.4(XTAL2) Y2.2(OSC2)
NetC19_1: C19.1 IC1.12(PH0/OSC_IN) Y1.2(OSC2)
NetC21_1: C21.1 IC1.13(PH1/OSC_OUT) Y1.1(OSC1)
NetC26_1: C26.1 IC1.49(VCAP_1)
NetC28_1: C28.1 IC1.73(VCAP_2)
NetD4_1: D4.1(K) R8.1
NetD4_2: D4.2(A) IC1.39(PE8/FSMC_D5/_TIM1_CH1N)
NetD5_1: D5.1(K) R11.1
NetD5_2: D5.2(A) IC1.40(PE9/FSMC_D6/TIM1_CH1)
NetD6_1: D6.1(K) R13.1
NetD6_2: D6.2(A) IC1.41(PE10/FSMC_D7/TIM1_CH2N)
NetD7_1: D7.1(K) R15.1
NetD7_2: D7.2(A) IC1.42(PE11/FSMC_D8/TIM1_CH2)
NetD8_1: D8.1(K) R21.1
NetD8_2: D8.2(A) IC1.43(PE12/FSMC_D9/TIM1_CH3N)
NetD9_1: D9.1(K) R22.1
NetD9_2: D9.2(A) IC1.44(PE13/FSMC_D10/TIM1_CH3)
NetD10_1: D10.1(K) R25.1
NetD10_2: D10.2(A) IC1.45(PE14/FSMC_D11/TIM1_CH4)
NetIC1_94: IC1.94(BOOT0) R37.2 SW1.2
NetLED2_2: LED2.2(A) R36.1
NetP1_9: P1.9(LED_G+) R20.2
NetP1_12: P1.12(LED_Y+) R23.2
NetR26_1: R26.1 U4.24(RBIAS)
NetR27_1: R27.1 U4.10(RX_ERR/PHYAD0)

Not connected (* = marked no-connect by the designer): IC1 1(PE2/TRACECLK/_FSMC_A23_/_ETH_MII_TXD3) 2(PE3/TRACED0/FSMC_A19) 3(PE4/TRACED1/FSMC_A20_/_DCMI_D4) 4(PE5/TRACED2_/_FSMC_A21_/_TIM9_CH1_/_DCMI_D6) 5(PE6/TRACED3_/_FSMC_A22_/_TIM9_CH2_/_DCMI_D7) 6(VBAT) 7(PC13/RTC_OUT,_RTC_TAMP1,_RTC_TS)* 8(PC14/OSC32_IN)* 9(PC15/OSC32_OUT)* 15(PC0/OTG_HS_ULPI_STP/ADC123_IN10) 17(PC2/SPI2_MISO_/_OTG_HS_ULPI_DIR_/_ETH_MII_TXD2_/I2S2ext_SD/ADC123_IN12) 18(PC3/SPI2_MOSI_/_I2S2_SD_/_OTG_HS_ULPI_NXT_/_ETH_MII_TX_CL/ADC123_IN13) 23(PA0/USART2_CTS/_UART4_TX/_ETH_MII_CRS_/_TIM2_CH1_ETR/_TIM5_CH1_/_TIM8_ETR/ADC123_IN/WKUP) 26(PA3/USART2_RX/TIM5_CH4_/_TIM9_CH2_/_TIM2_CH4_/_OTG_HS_ULPI_D0_/_ETH_MII_COL/ADC123_IN3) 29(PA4/SPI1_NSS_/_SPI3_NSS_/_USART2_CK_/_DCMI_HSYNC_/_OTG_HS_SOF/_I2S3_WS/_ADC12_IN4_/DAC_OUT1) 30(PA5/SPI1_SCK/_OTG_HS_ULPI_CK_/_TIM2_CH1_ETR/_TIM8_CH1N/_ADC12_IN5/DAC__OUT2) 31(PA6/SPI1_MISO_/_TIM8_BKIN/TIM13_CH1_/_DCMI_PIXCLK_/_TIM3_CH1_/_TIM1_BKIN/_ADC12_IN6) 35(PB0/TIM3_CH3_/_TIM8_CH2N/_OTG_HS_ULPI_D1/_ETH_MII_RXD2_/_TIM1_CH2N/_ADC12_IN8) 36(PB1/TIM3_CH4_/_TIM8_CH3N/_OTG_HS_ULPI_D2/_ETH_MII_RXD3_/_TIM1_CH3N/_ADC12_IN9) 37(PB2/BOOT1) 38(PE7/FSMC_D4/TIM1_ETR) 46(PE15/FSMC_D12/TIM1_BKIN) 84(PD3/FSMC_CLK/_USART2_CTS) 88(PD7/USART2_CK/FSMC_NE1/_FSMC_NCE2) 91(PB5/I2C1_SMBA/_CAN2_RX_/_OTG_HS_ULPI_D7_/_ETH_PPS_OUT/TIM3_CH2_/_SPI1_MOSI/_SPI3_MOSI_/_DCMI_D10) 92(PB6/I2C1_SCL/_TIM4_CH1_/_CAN2_TX_/_DCMI_D5/USART1_TX) 93(PB7/I2C1_SDA_/_FSMC_NL_/_DCMI_VSYNC_/_USART1_RX/_TIM4_CH2) 97(PE0/TIM4_ETR_/_FSMC_NBL0_/_DCMI_D2) 98(PE1/FSMC_NBL1_/_DCMI_D3); J4 4

### Layout directives
differential pair: RX_N, RX_P, TX_N, TX_P

### Notes on the sheet
- MODE7
- REGOFF=0
  nINTSEL=0
- Sửa đổi
- 1
- Miêu tả
- CHỈNH SỬA
- Khu vực
- Thời gian
- 2
- 3
- 4
- THIẾT KẾ:
- Họ Tên
- Chữ ký
- Ngày ký
- TỔNG CÔNG TY CÔNG NGHIỆP CNC VIETTEL
- TRUNG TÂM CN CK & TĐH
- Mã dự án
- XUẤT BẢN VẼ:
- Bản vẽ thiết kế sơ đồ nguyên lý
- KHỐI 1
- Mã thiết bị
- KIỂM TRA:
- Mã bản vẽ
- Mã phiên bản
- Kích thước
- Trang
- PHÊ DUYỆT:
- Tên file:
- A2
- (in symbol C0603_22p_50V) 22p
- (in symbol C0603_33p_50V) 33p
- (in symbol C0603_103_50V) 103
- (in symbol C0603_106_10V) 106
- (in symbol C0603_106_35V) 106
- (in symbol LAN_8720) LAN8720
- (in symbol R0603_1k5) 1k5
- (in symbol R0603_10k) 10k
- (in symbol R0603_12k1) 12k1
- (in symbol R0603_49k9) 49k9
- (in symbol R0603_430R) 430R
- (in symbol R0603_750R) 750R

### Library data of the parts
C15 C20 C23 C24 C26 C28-C32 = C0603_106_35V: as C10 on sheet [1]-Power; Datasheet Link: http://componentsearchengine.com/Datasheets/1/GRM188R6YA106MA73J.pdf; Height: 0.9mm; Mouser Part Number: 81-GRM188R6YA106MA3J; Mouser Price/Stock: https://www.mouser.co.uk/ProductDetail/Murata-Electronics/GRM188R6YA106MA73J?qs=5aG0NVq1C4xLSwNPdfnaYg%3D%3D; Arrow Part Number: GRM188R6YA106MA73J; Arrow Price/Stock: https://www.arrow.com/en/products/grm188r6ya106ma73j/murata-manufacturing?region=europe
C16-C18 = C0603_15pF_50V: Multilayer Ceramic Capacitors MLCC - SMD/SMT NEW GLOBAL PN KGM15ACG1H150JT 50V 15pF C0G 0603 5%; Manufacturer_Name: AVX; Manufacturer_Part_Number: 06035A150JAT2A; Datasheet Link: https://componentsearchengine.com/Datasheets/1/06031A100FAT2A.pdf; Height: 0.9mm; Mouser Part Number: 581-06035A150J; Mouser Price/Stock: https://www.mouser.co.uk/ProductDetail/AVX/06035A150JAT2A?qs=3rcAE6pfQ0JnoMeE2zwnBw%3D%3D; Arrow Part Number: 06035A150JAT2A; Arrow Price/Stock: https://www.arrow.com/en/products/06035a150jat2a/avx
C19 C21 = C0603_22p_50V: Multilayer Ceramic Capacitors MLCC - SMD/SMT 50 V 22 pF C0G 0603 5%; Manufacturer_Name: KEMET; Manufacturer_Part_Number: CC0603JRNPO9BN220; Datasheet Link: http://componentsearchengine.com/Datasheets/1/CC0603JRNPO9BN220.pdf; Mouser Part Number: 603-CC603JRNPO9BN220; Mouser Price/Stock: https://www.mouser.co.uk/ProductDetail/YAGEO/CC0603JRNPO9BN220?qs=vTakOoo5QyIVMYOUTI%2F4zA%3D%3D; Arrow Part Number: CC0603JRNPO9BN220; Arrow Price/Stock: https://www.arrow.com/en/products/cc0603jrnpo9bn220/yageo?region=nac
C22 = C0603_106_10V: Multilayer Ceramic Capacitors MLCC - SMD/SMT 10 uF 10 VDC 10% 0603 X7T; Manufacturer_Name: Murata Electronics; Manufacturer_Part_Number: GRM188D71A106KA73D; Datasheet Link: https://psearch.en.murata.com/capacitor/product/GRM188D71A106KA73%23.html; Height: 0.9mm; Mouser Part Number: 81-GRM188D71A106KA3D; Mouser Price/Stock: https://www.mouser.co.uk/ProductDetail/Murata-Electronics/GRM188D71A106KA73D?qs=FvQ4nYu%252B2He2GIhYKxXmMQ%3D%3D; Arrow Part Number: GRM188D71A106KA73D; Arrow Price/Stock: https://www.arrow.com/en/products/grm188d71a106ka73d/murata-manufacturing?region=nac
C25 C27 = C0603_33p_50V: Multilayer Ceramic Capacitors MLCC - SMD/SMT 50 V 33 pF C0G 0603 5%; Manufacturer_Name: KEMET; Manufacturer_Part_Number: CC0603JRNPO9BN330; Mouser Part Number: 603-C0603JRNPO9BN330; Mouser Price/Stock: https://www.mouser.co.uk/ProductDetail/YAGEO/CC0603JRNPO9BN330?qs=lZqiD2QyRYLjCkv0j7NsKQ%3D%3D; Arrow Part Number: CC0603JRNPO9BN330; Arrow Price/Stock: https://www.arrow.com/en/products/cc0603jrnpo9bn330/yageo?region=nac
C33 = C0603_103_50V: as C3 on sheet [1]-Power; Datasheet Link: https://datasheet.datasheetarchive.com/originals/distributors/Datasheets_SAMA/d9f127a4875522309d99aa7dec79633c.pdf; Height: 0.9mm; Mouser Part Number: 603-CC603KRX7R9BB103; Mouser Price/Stock: https://www.mouser.co.uk/ProductDetail/YAGEO/CC0603KRX7R9BB103?qs=AgBp2OyFlx%252BeoRRspw6PJg%3D%3D; Arrow Part Number: CC0603KRX7R9BB103; Arrow Price/Stock: https://www.arrow.com/en/products/cc0603krx7r9bb103/yageo?region=nac
D4-D10 = LED0603_Red: Red 625nm LED Indication - Discrete 2V 0603 (1608 Metric); Manufacturer_Name: Wurth Elektronik; Manufacturer_Part_Number: 150060RS75000; Datasheet Link: http://katalog.we-online.de/led/datasheet/150060RS75000.pdf; Height: 0.8mm; Mouser Part Number: 710-150060RS75000; Mouser Price/Stock: https://www.mouser.co.uk/ProductDetail/Wurth-Elektronik/150060RS75000?qs=LlUlMxKIyB3QnmZ3fw%2FVCA%3D%3D
FB4 = FERRIT_0603_500mA: Manufacturer: Murata Electronics North America; Part Number: BLM18HE152SN1D; info: FERRITE BEAD 1.5 KOHM 0603 1LN; Temperature: -55°C ~ 125°C; URL: https://www.digikey.com/product-detail/en/murata-electronics-north-america/BLM18HE152SN1D/490-5216-1-ND/1948392; Price: 0.21
IC1 = STM32F407VGT7: Integrated Circuit; Manufacturer_Name: STMicroelectronics; Datasheet Link: http://www.st.com/content/ccc/resource/technical/document/datasheet/ef/92/76/6d/bb/c2/4f/f7/DM00037051.pdf/files/DM00037051.pdf/jcr:content/translations/en.DM00037051.pdf; Height: 1.6mm; Manufacturer_Part_Number: STM32F407VGT7; Mouser Part Number: 511-STM32F407VGT7; Mouser Price/Stock: https://www.mouser.co.uk/ProductDetail/STMicroelectronics/STM32F407VGT7?qs=%2F%2FVjtefuLz5JNRfO7nioEQ%3D%3D; Arrow Part Number: STM32F407VGT7; Arrow Price/Stock: https://www.arrow.com/en/products/stm32f407vgt7/stmicroelectronics?region=nac
J3 = Header_5P_Male Pin: Headers & Wire Housings 5CKT VERT HDR 2.54mm; Manufacturer_Name: Molex; Datasheet Link: https://www.molex.com/content/dam/molex/molex-dot-com/products/automated/en-us/salesdrawingpdf/423/42375/022284056_sd.pdf; Height: 8.63mm; Manufacturer_Part_Number: 22-28-4056; Mouser Part Number: 538-22-28-4056; Mouser Price/Stock: https://www.mouser.co.uk/ProductDetail/Molex/22-28-4056?qs=GAPJcf4kvdsjHo14eB9PPA%3D%3D
J4 = Header_1x4: Headers & Wire Housings WR-PHD 2.54mm Hdr 4P Single Str Gold; Manufacturer_Name: Wurth Elektronik; Manufacturer_Part_Number: 61300411121; Datasheet Link: http://katalog.we-online.de/em/datasheet/6130xx11121.pdf; Height: 8.54mm; Mouser Part Number: 710-61300411121; Mouser Price/Stock: https://www.mouser.co.uk/ProductDetail/Wurth-Elektronik/61300411121?qs=PhR8RmCirEYQcLLqXD8rAA%3D%3D
LED2 = LED0603_Blue: as LED1 on sheet [1]-Power; Datasheet Link: https://componentsearchengine.com/Datasheets/2/150060BS75000.pdf; Height: 0.8mm; Mouser Part Number: 710-150060BS75000; Mouser Price/Stock: https://www.mouser.co.uk/ProductDetail/Wurth-Elektronik/150060BS75000?qs=LlUlMxKIyB2DLLpXQThavA%3D%3D
R4-R7 = R0603_49k9: Resistor; Manufacturer_Name: Panasonic; Manufacturer_Part_Number: ERJ-3EKF4992V; Datasheet Link: http://industrial.panasonic.com/cdbs/www-data/pdf/RDA0000/AOA0000C86.pdf; Height: 0.55mm; Mouser Part Number: 667-ERJ-3EKF4992V; Mouser Price/Stock: https://www.mouser.co.uk/ProductDetail/Panasonic/ERJ-3EKF4992V?qs=66DK8nO8gJDYHn0m%2Fug%252Bvw%3D%3D; Arrow Part Number: ERJ-3EKF4992V; Arrow Price/Stock: https://www.arrow.com/en/products/erj-3ekf4992v/panasonic?region=europe
R8 R11 R13 R15 R18 R19 R21 R22 R25 R36 = R0603_1k5: Resistor; Manufacturer_Name: Panasonic; Manufacturer_Part_Number: ERJ-3EKF1501V; Datasheet Link: http://industrial.panasonic.com/cdbs/www-data/pdf/RDA0000/AOA0000C86.pdf; Height: 0.55mm; Mouser Part Number: 667-ERJ-3EKF1501V; Mouser Price/Stock: https://www.mouser.co.uk/ProductDetail/Panasonic/ERJ-3EKF1501V?qs=H7k1u0Mp9JTu8xEF0m60uQ%3D%3D; Arrow Part Number: ERJ-3EKF1501V; Arrow Price/Stock: https://www.arrow.com/en/products/erj-3ekf1501v/panasonic?region=nac
R9 R10 R12 R14 R16 R17 R24 R27-R31 R34 R35 R37 = R0603_10k: as R2 on sheet [1]-Power; Datasheet Link: http://industrial.panasonic.com/cdbs/www-data/pdf/RDA0000/AOA0000C86.pdf; Height: 0.55mm; Mouser Part Number: 667-ERJ-3EKF1002V; Mouser Price/Stock: https://www.mouser.co.uk/ProductDetail/Panasonic/ERJ-3EKF1002V?qs=H7k1u0Mp9JSrGPQ5%2F5COuw%3D%3D; Arrow Part Number: ERJ-3EKF1002V; Arrow Price/Stock: https://www.arrow.com/en/products/erj-3ekf1002v/panasonic?region=europe
R20 R23 = R0603_430R: Resistor; Manufacturer_Name: Panasonic; Manufacturer_Part_Number: ERJ-3EKF4300V; Datasheet Link: http://industrial.panasonic.com/cdbs/www-data/pdf/RDA0000/AOA0000C86.pdf; Height: 0.55mm; Mouser Part Number: 667-ERJ-3EKF4300V; Mouser Price/Stock: https://www.mouser.co.uk/ProductDetail/Panasonic/ERJ-3EKF4300V?qs=MVjVSMjNRMqNBqT08tpKJg%3D%3D; Arrow Part Number: ERJ-3EKF4300V; Arrow Price/Stock: https://www.arrow.com/en/products/erj-3ekf4300v/panasonic
R26 = R0603_12k1: Resistor; Manufacturer_Name: Panasonic; Manufacturer_Part_Number: ERJ-3EKF1212V; Datasheet Link: http://industrial.panasonic.com/cdbs/www-data/pdf/RDA0000/AOA0000C86.pdf; Height: 0.55mm; Mouser Part Number: 667-ERJ-3EKF1212V; Mouser Price/Stock: https://www.mouser.co.uk/ProductDetail/Panasonic/ERJ-3EKF1212V?qs=H7k1u0Mp9JSwY%2Fx4ysLibg%3D%3D; Arrow Part Number: ERJ-3EKF1212V; Arrow Price/Stock: https://www.arrow.com/en/products/erj-3ekf1212v/panasonic
R32 R33 = R0603_750R: Resistor; Manufacturer_Name: Panasonic; Manufacturer_Part_Number: ERJ-3EKF7500V; Datasheet Link: http://industrial.panasonic.com/cdbs/www-data/pdf/RDA0000/AOA0000C86.pdf; Height: 0.55mm; Mouser Part Number: 667-ERJ-3EKF7500V; Mouser Price/Stock: https://www.mouser.co.uk/ProductDetail/Panasonic/ERJ-3EKF7500V?qs=W%252B6c3YqutMuhUZCITjFq0Q%3D%3D; Arrow Part Number: ERJ-3EKF7500V; Arrow Price/Stock: https://www.arrow.com/en/products/erj-3ekf7500v/panasonic?region=nac
SW1 SW2 = BUTTON_SMD: Manufacturer: C&K; Part Number: RS-282G05A3-SM RT; info: SWITCH TACTILE SPST-NO 0.05A 12V; Temperature: *; URL: https://www.digikey.com/product-detail/en/c-k/RS-282G05A3-SM-RT/CKN10384CT-ND/2747203; Price: 0.81; Manufacturer Part Number: RS-282G05A3-SM RT
U4 = LAN_8720: Manufacturer: Microchip Technology; Part Number: LAN8710AI-EZK-TR; info: IC TXRX ETHERNET 32QFN; Temperature: -40°C ~ 85°C; URL: https://www.digikey.com/product-detail/en/microchip-technology/LAN8710AI-EZK-TR/LAN8710AI-EZK-CT-ND/5043019; Price: 1.61
Y1 = CRYSTAL_8MHz_SMD: Manufacturer: Diodes Incorporated; Part Number: F90800018Q; info: CRYSTAL 8.0000MHZ 8PF SMD; Temperature: -40°C ~ 125°C; URL: https://www.digikey.com/en/products/detail/diodes-incorporated/F90800018Q/6111445; Price: 1.07; Manufacturer Part Number: F90800018Q
Y2 = CRYSTAL_25MHz: Manufacturer: ECS Inc.; Part Number: ECS-250-18-4-F; info: CRYSTAL 25.0000MHZ 18PF T/H; Temperature: -55°C ~ 125°C; URL: https://www.digikey.com/product-detail/en/ecs-inc/ECS-250-18-4-F/X231-ND/332427; Price: 0.69

## Sheet [3]-Digital Input.SchDoc
size A2; DocumentNumber: 3; SheetNumber: 3; SheetTotal: 5
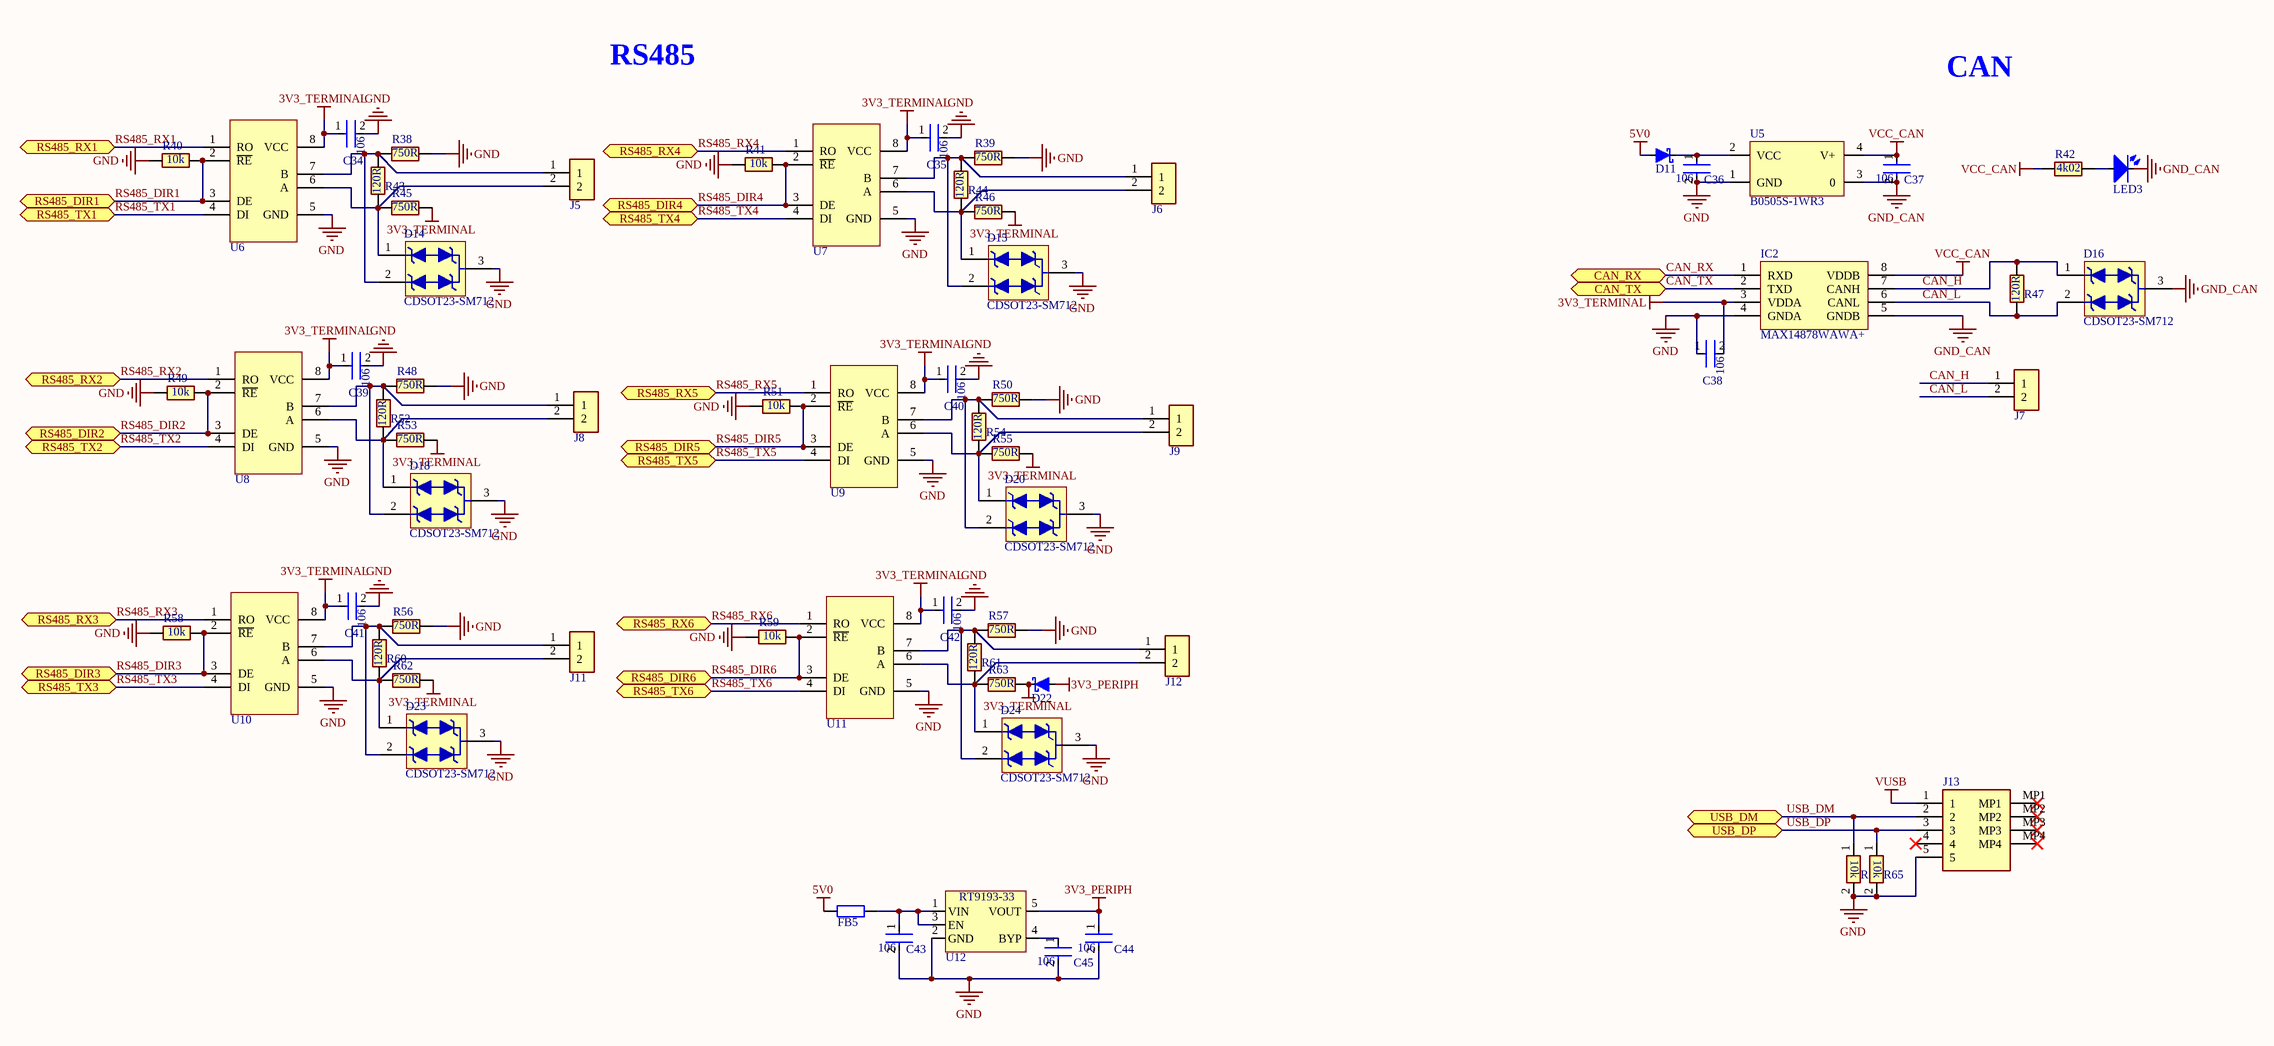
[diagram p3: [3]-Digital Input.SchDoc]

### Parts
C34  C0603_106_35V  [C0603]  (value not drawn)
C35  C0603_106_35V  [C0603]  (value not drawn)
C36  C0603_106_35V  [C0603]  (value not drawn)
C37  C0603_106_35V  [C0603]  (value not drawn)
C38  C0603_106_35V  [C0603]  (value not drawn)
C39  C0603_106_35V  [C0603]  (value not drawn)
C40  C0603_106_35V  [C0603]  (value not drawn)
C41  C0603_106_35V  [C0603]  (value not drawn)
C42  C0603_106_35V  [C0603]  (value not drawn)
C43  C0603_106_35V  [C0603]  (value not drawn)
C44  C0603_106_35V  [C0603]  (value not drawn)
C45  C0603_106_35V  [C0603]  (value not drawn)
D11  PMEG40T30ERX  [SOD123]  (value not drawn)
D14  CDSOT23-SM712  [SOT-23]
D15  CDSOT23-SM712  [SOT-23]
D16  CDSOT23-SM712  [SOT-23]
D18  CDSOT23-SM712  [SOT-23]
D20  CDSOT23-SM712  [SOT-23]
D22  PMEG40T30ERX  [SOD123]  (value not drawn)
D23  CDSOT23-SM712  [SOT-23]
D24  CDSOT23-SM712  [SOT-23]
FB5  FERRIT_0805_1A  [FB0805]  (value not drawn)
IC2  MAX14878WAWA+  [8-SOIC-W]
J5  Terminal_2P_5.08mm  [1729128]  (value not drawn)
J6  Terminal_2P_5.08mm  [1729128]  (value not drawn)
J7  Terminal_2P_5.08mm  [1729128]  (value not drawn)
J8  Terminal_2P_5.08mm  [1729128]  (value not drawn)
J9  Terminal_2P_5.08mm  [1729128]  (value not drawn)
J11  Terminal_2P_5.08mm  [1729128]  (value not drawn)
J12  Terminal_2P_5.08mm  [1729128]  (value not drawn)
J13  1734035-3  [17340353]  (value not drawn)
LED3  LED0603_Blue  [LED0603]  (value not drawn)
R38  R0603_750R  [RES-SMD-0603]  (value not drawn)
R39  R0603_750R  [RES-SMD-0603]  (value not drawn)
R40  R0603_10k  [RES-SMD-0603]  (value not drawn)
R41  R0603_10k  [RES-SMD-0603]  (value not drawn)
R42  R0603_4k02  [RES-SMD-0603]  (value not drawn)
R43  R0603_120R  [RES-SMD-0603]  (value not drawn)
R44  R0603_120R  [RES-SMD-0603]  (value not drawn)
R45  R0603_750R  [RES-SMD-0603]  (value not drawn)
R46  R0603_750R  [RES-SMD-0603]  (value not drawn)
R47  R0603_120R  [RES-SMD-0603]  (value not drawn)
R48  R0603_750R  [RES-SMD-0603]  (value not drawn)
R49  R0603_10k  [RES-SMD-0603]  (value not drawn)
R50  R0603_750R  [RES-SMD-0603]  (value not drawn)
R51  R0603_10k  [RES-SMD-0603]  (value not drawn)
R52  R0603_120R  [RES-SMD-0603]  (value not drawn)
R53  R0603_750R  [RES-SMD-0603]  (value not drawn)
R54  R0603_120R  [RES-SMD-0603]  (value not drawn)
R55  R0603_750R  [RES-SMD-0603]  (value not drawn)
R56  R0603_750R  [RES-SMD-0603]  (value not drawn)
R57  R0603_750R  [RES-SMD-0603]  (value not drawn)
R58  R0603_10k  [RES-SMD-0603]  (value not drawn)
R59  R0603_10k  [RES-SMD-0603]  (value not drawn)
R60  R0603_120R  [RES-SMD-0603]  (value not drawn)
R61  R0603_120R  [RES-SMD-0603]  (value not drawn)
R62  R0603_750R  [RES-SMD-0603]  (value not drawn)
R63  R0603_750R  [RES-SMD-0603]  (value not drawn)
R64  R0603_10k  [RES-SMD-0603]  (value not drawn)
R65  R0603_10k  [RES-SMD-0603]  (value not drawn)
U5  B0505S-1WR3  [B0505S-1WR3]
U6  MAX3485  [8-SOIC]  (value not drawn)
U7  MAX3485  [8-SOIC]  (value not drawn)
U8  MAX3485  [8-SOIC]  (value not drawn)
U9  MAX3485  [8-SOIC]  (value not drawn)
U10  MAX3485  [8-SOIC]  (value not drawn)
U11  MAX3485  [8-SOIC]  (value not drawn)
U12  RT9193-33GB  [SOT-23-5]  (value not drawn)

### Ports
CAN_RX (bidir), CAN_TX (bidir), RS485_DIR1 (bidir), RS485_DIR2 (bidir), RS485_DIR3 (bidir), RS485_DIR4 (bidir), RS485_DIR5 (bidir), RS485_DIR6 (bidir), RS485_RX1 (bidir), RS485_RX2 (bidir), RS485_RX3 (bidir), RS485_RX4 (bidir), RS485_RX5 (bidir), RS485_RX6 (bidir), RS485_TX1 (bidir), RS485_TX2 (bidir), RS485_TX3 (bidir), RS485_TX4 (bidir), RS485_TX5 (bidir), RS485_TX6 (bidir), USB_DM (bidir), USB_DP (bidir)

### Nets
3V3_PERIPH: C44.1 D22.1(A) U12.5(VOUT)
3V3_TERMINAL: C34.1 C35.1 C38.2 C39.1 C40.1 C41.1 C42.1 D22.2(K) IC2.3(VDDA) R45.2 R46.2 R53.2 R55.2 R62.2 R63.2 U6.8(VCC) U7.8(VCC) U8.8(VCC) U9.8(VCC) U10.8(VCC) U11.8(VCC)
5V0: D11.1(A) FB5.1
GND: C34.2 C35.2 C36.2 C38.1 C39.2 C40.2 C41.2 C42.2 C43.2 C44.2 C45.2 D14.3 D15.3 D18.3 D20.3 D23.3 D24.3 IC2.4(GNDA) J13.5 R38.2 R39.2 R40.1 R41.1 R48.2 R49.1 R50.2 R51.1 R56.2 R57.2 R58.1 R59.1 R64.2 R65.2 U5.1(GND) U6.5(GND) U7.5(GND) U8.5(GND) U9.5(GND) U10.5(GND) U11.5(GND) U12.2(GND)
GND_CAN: C37.2 D16.3 IC2.5(GNDB) LED3.1(K) U5.3(0)
VCC_CAN: C37.1 IC2.8(VDDB) R42.1 U5.4(V+)
VUSB: J13.1
CAN_H: D16.1 IC2.7(CANH) J7.1 R47.2
CAN_L: D16.2 IC2.6(CANL) J7.2 R47.1
CAN_RX: IC2.1(RXD) ; port CAN_RX
CAN_TX: IC2.2(TXD) ; port CAN_TX
RS485_DIR1: R40.2 U6.2(~{RE}) U6.3(DE) ; port RS485_DIR1
RS485_DIR2: R49.2 U8.2(~{RE}) U8.3(DE) ; port RS485_DIR2
RS485_DIR3: R58.2 U10.2(~{RE}) U10.3(DE) ; port RS485_DIR3
RS485_DIR4: R41.2 U7.2(~{RE}) U7.3(DE) ; port RS485_DIR4
RS485_DIR5: R51.2 U9.2(~{RE}) U9.3(DE) ; port RS485_DIR5
RS485_DIR6: R59.2 U11.2(~{RE}) U11.3(DE) ; port RS485_DIR6
RS485_RX1: U6.1(RO) ; port RS485_RX1
RS485_RX2: U8.1(RO) ; port RS485_RX2
RS485_RX3: U10.1(RO) ; port RS485_RX3
RS485_RX4: U7.1(RO) ; port RS485_RX4
RS485_RX5: U9.1(RO) ; port RS485_RX5
RS485_RX6: U11.1(RO) ; port RS485_RX6
RS485_TX1: U6.4(DI) ; port RS485_TX1
RS485_TX2: U8.4(DI) ; port RS485_TX2
RS485_TX3: U10.4(DI) ; port RS485_TX3
RS485_TX4: U7.4(DI) ; port RS485_TX4
RS485_TX5: U9.4(DI) ; port RS485_TX5
RS485_TX6: U11.4(DI) ; port RS485_TX6
USB_DM: J13.2 R64.1 ; port USB_DM
USB_DP: J13.3 R65.1 ; port USB_DP
NetC36_1: C36.1 D11.2(K) U5.2(VCC)
NetC43_1: C43.1 FB5.2 U12.1(VIN) U12.3(EN)
NetC45_1: C45.1 U12.4(BYP)
NetD14_1: D14.1 J5.2 R43.1 R45.1 U6.6(A)
NetD14_2: D14.2 J5.1 R38.1 R43.2 U6.7(B)
NetD15_1: D15.1 J6.2 R44.1 R46.1 U7.6(A)
NetD15_2: D15.2 J6.1 R39.1 R44.2 U7.7(B)
NetD18_1: D18.1 J8.2 R52.1 R53.1 U8.6(A)
NetD18_2: D18.2 J8.1 R48.1 R52.2 U8.7(B)
NetD20_1: D20.1 J9.2 R54.1 R55.1 U9.6(A)
NetD20_2: D20.2 J9.1 R50.1 R54.2 U9.7(B)
NetD23_1: D23.1 J11.2 R60.1 R62.1 U10.6(A)
NetD23_2: D23.2 J11.1 R56.1 R60.2 U10.7(B)
NetD24_1: D24.1 J12.2 R61.1 R63.1 U11.6(A)
NetD24_2: D24.2 J12.1 R57.1 R61.2 U11.7(B)
NetLED3_2: LED3.2(A) R42.2

Not connected (* = marked no-connect by the designer): J13 4* MP1* MP2* MP3* MP4*

### Notes on the sheet
- RS485
- CAN
- Sửa đổi
- 1
- Miêu tả
- CHỈNH SỬA
- Khu vực
- Thời gian
- 2
- 3
- 4
- THIẾT KẾ:
- Họ Tên
- Chữ ký
- Ngày ký
- TỔNG CÔNG TY CÔNG NGHIỆP CNC VIETTEL
- TRUNG TÂM CN CK & TĐH
- Mã dự án
- XUẤT BẢN VẼ:
- Bản vẽ thiết kế sơ đồ nguyên lý
- KHỐI 1
- Mã thiết bị
- KIỂM TRA:
- Mã bản vẽ
- Mã phiên bản
- Kích thước
- Trang
- PHÊ DUYỆT:
- Tên file:
- A2
- (in symbol C0603_106_35V) 106
- (in symbol R0603_4k02) 4k02
- (in symbol R0603_10k) 10k
- (in symbol R0603_120R) 120R
- (in symbol R0603_750R) 750R
- (in symbol RT9193-33GB) RT9193-33

### Library data of the parts
C34-C45 = C0603_106_35V: as C10 on sheet [1]-Power; Datasheet Link: http://componentsearchengine.com/Datasheets/1/GRM188R6YA106MA73J.pdf; Height: 0.9mm; Mouser Part Number: 81-GRM188R6YA106MA3J; Mouser Price/Stock: https://www.mouser.co.uk/ProductDetail/Murata-Electronics/GRM188R6YA106MA73J?qs=5aG0NVq1C4xLSwNPdfnaYg%3D%3D; Arrow Part Number: GRM188R6YA106MA73J; Arrow Price/Stock: https://www.arrow.com/en/products/grm188r6ya106ma73j/murata-manufacturing?region=europe
D11 D22 = PMEG40T30ERX: as D1 on sheet [1]-Power; Datasheet Link: https://assets.nexperia.com/documents/data-sheet/PMEG40T30ER.pdf; Height: 1.1mm; Manufacturer_Part_Number: PMEG40T30ERX; Mouser Part Number: 771-PMEG40T30ERX; Mouser Price/Stock: https://www.mouser.co.uk/ProductDetail/Nexperia/PMEG40T30ERX?qs=1mbolxNpo8eeG%2Fr5KLvXLA%3D%3D; Arrow Part Number: PMEG40T30ERX; Arrow Price/Stock: https://www.arrow.com/en/products/pmeg40t30erx/nexperia?region=europe
D14-D16 D18 D20 D23 D24 = CDSOT23-SM712: Manufacturer: Bourns Inc.; Info: TVS DIODE 7V/12V 14V/26V SOT23-3; Part Number: CDSOT23-SM712; Temperature: -55°C ~ 150°C (TJ); URL: https://www.digikey.com/product-detail/en/bourns-inc/CDSOT23-SM712/CDSOT23-SM712CT-ND/1630607; Price: 1.49
FB5 = FERRIT_0805_1A: as FB1 on sheet [1]-Power; Temperature: -40°C ~ 125°C; URL: https://www.digikey.com/en/products/detail/laird-signal-integrity-products/MI0805J102R-10/1015975; Price: 0.2; Manufacturer Part Number: MI0805J102R-10
IC2 = MAX14878WAWA+: Integrated Circuit; Manufacturer_Name: Analog Devices; Datasheet Link: https://datasheets.maximintegrated.com/en/ds/MAX14878-MAX14880.pdf; Height: 2.65mm; Manufacturer_Part_Number: MAX14878WAWA+; Mouser Part Number: 700-MAX14878WAWA+; Mouser Price/Stock: https://www.mouser.co.uk/ProductDetail/Maxim-Integrated/MAX14878WAWA%2b?qs=zW32dvEIR3sEVkmu8Yl9AA%3D%3D
J5-J9 J11 J12 = Terminal_2P_5.08mm: as J1 on sheet [1]-Power; Datasheet Link: http://www.phoenixcontact.net/product/1729128; Height: 10.15mm; Manufacturer_Part_Number: 1729128; Mouser Part Number: 651-1729128; Mouser Price/Stock: https://www.mouser.co.uk/ProductDetail/Phoenix-Contact/1729128?qs=GFUSqQMLmmnCBVBY3dts9w%3D%3D; Arrow Part Number: 1729128; Arrow Price/Stock: https://www.arrow.com/en/products/1729128/phoenix-contact?region=nac
J13 = 1734035-3: Connector; Manufacturer_Name: TE Connectivity; Datasheet Link: https://www.te.com/commerce/DocumentDelivery/DDEController?Action=srchrtrv&DocNm=1654270-2&DocType=Catalog%20Section&DocLang=English&PartCntxt=1734035-3&DocFormat=pdf; Height: 3.95mm; Manufacturer_Part_Number: 1734035-3; Mouser Part Number: 571-1734035-3; Mouser Price/Stock: https://www.mouser.co.uk/ProductDetail/TE-Connectivity/1734035-3?qs=JQ0T48ZyHbB%2Fl8a%2FPKP6Xw%3D%3D; Arrow Part Number: 1734035-3; Arrow Price/Stock: https://www.arrow.com/en/products/1734035-3/te-connectivity?region=nac
LED3 = LED0603_Blue: as LED1 on sheet [1]-Power; Datasheet Link: https://componentsearchengine.com/Datasheets/2/150060BS75000.pdf; Height: 0.8mm; Mouser Part Number: 710-150060BS75000; Mouser Price/Stock: https://www.mouser.co.uk/ProductDetail/Wurth-Elektronik/150060BS75000?qs=LlUlMxKIyB2DLLpXQThavA%3D%3D
R38 R39 R45 R46 R48 R50 R53 R55-R57 R62 R63 = R0603_750R: as R32 on sheet [2]-MCU; Datasheet Link: http://industrial.panasonic.com/cdbs/www-data/pdf/RDA0000/AOA0000C86.pdf; Height: 0.55mm; Mouser Part Number: 667-ERJ-3EKF7500V; Mouser Price/Stock: https://www.mouser.co.uk/ProductDetail/Panasonic/ERJ-3EKF7500V?qs=W%252B6c3YqutMuhUZCITjFq0Q%3D%3D; Arrow Part Number: ERJ-3EKF7500V; Arrow Price/Stock: https://www.arrow.com/en/products/erj-3ekf7500v/panasonic?region=nac
R40 R41 R49 R51 R58 R59 R64 R65 = R0603_10k: as R2 on sheet [1]-Power; Datasheet Link: http://industrial.panasonic.com/cdbs/www-data/pdf/RDA0000/AOA0000C86.pdf; Height: 0.55mm; Mouser Part Number: 667-ERJ-3EKF1002V; Mouser Price/Stock: https://www.mouser.co.uk/ProductDetail/Panasonic/ERJ-3EKF1002V?qs=H7k1u0Mp9JSrGPQ5%2F5COuw%3D%3D; Arrow Part Number: ERJ-3EKF1002V; Arrow Price/Stock: https://www.arrow.com/en/products/erj-3ekf1002v/panasonic?region=europe
R42 = R0603_4k02: Resistor; Manufacturer_Name: Panasonic; Manufacturer_Part_Number: ERJ-3EKF4021V; Datasheet Link: http://industrial.panasonic.com/cdbs/www-data/pdf/RDA0000/AOA0000C86.pdf; Height: 0.55mm; Mouser Part Number: 667-ERJ-3EKF4021V; Mouser Price/Stock: https://www.mouser.com/Search/Refine.aspx?Keyword=667-ERJ-3EKF4021V; Arrow Part Number: ERJ-3EKF4021V; Arrow Price/Stock: https://www.arrow.com/en/products/erj-3ekf4021v/panasonic
R43 R44 R47 R52 R54 R60 R61 = R0603_120R: Thick Film Resistors - SMD 0603 120ohms 1% AEC-Q200; Manufacturer_Name: Panasonic; Manufacturer_Part_Number: ERJ-3EKF1200V; Datasheet Link: http://industrial.panasonic.com/cdbs/www-data/pdf/RDA0000/AOA0000C86.pdf; Height: 0.55mm; Mouser Part Number: 667-ERJ-3EKF1200V; Mouser Price/Stock: https://www.mouser.co.uk/ProductDetail/Panasonic/ERJ-3EKF1200V?qs=iBwFsHVUAOfkZ4Bj0qjBGg%3D%3D; Arrow Part Number: ERJ-3EKF1200V; Arrow Price/Stock: https://www.arrow.com/en/products/erj-3ekf1200v/panasonic?region=nac
U5 = B0505S-1WR3: Manufacturer: Mornsun America, LLC; Info: Isolated Module DC DC Converter 1 Output 5V - - - 200mA 4.5V - 5.5V Input; Part Number: B0505S-1WR3; Temperature: -40°C ~ 105°C; URL: https://www.digikey.com/en/products/detail/mornsun-america-llc/B0505S-1WR3/13168098?s=N4IgTCBcDaIEIAYCsyDKBaAjAdQEoGYQBdAXyA; Price: 5.23; Manufacturer Part Number: B0505S-1WR3
U6-U11 = MAX3485: Manufacturer: Maxim Integrated; Part Number: MAX3485EESA+; info: IC TRANSCEIVER HALF 1/1 8SOIC; Temperature: -40°C ~ 85°C; URL: https://www.digikey.com/product-detail/en/maxim-integrated/MAX3485EESA/MAX3485EESA-ND/1702243; Price: 3.91
U12 = RT9193-33GB: as U2 on sheet [1]-Power; Part Number: RT9193-33GB; Temperature: -40°C ~ 125°C; URL: https://www.digikey.com/en/products/detail/richtek-usa-inc/RT9193-33GB/2470048?s=N4IgTCBcDaIEoBUCcBGJBmAtO9BxAQiALoC%2BQA; Price: 0.56; Type: IC; Manufacturer Part Number: RT9193-33GB